# Altium schematic sheet Button.SchDoc
size 420 x 297 mm; Address1: Address1; Address2: Address2; Address3: Address3; Address4: Address4; DocumentNumber: *Э3; SheetNumber: 9; SheetTotal: 15; DocumentType: Схема электрическая *
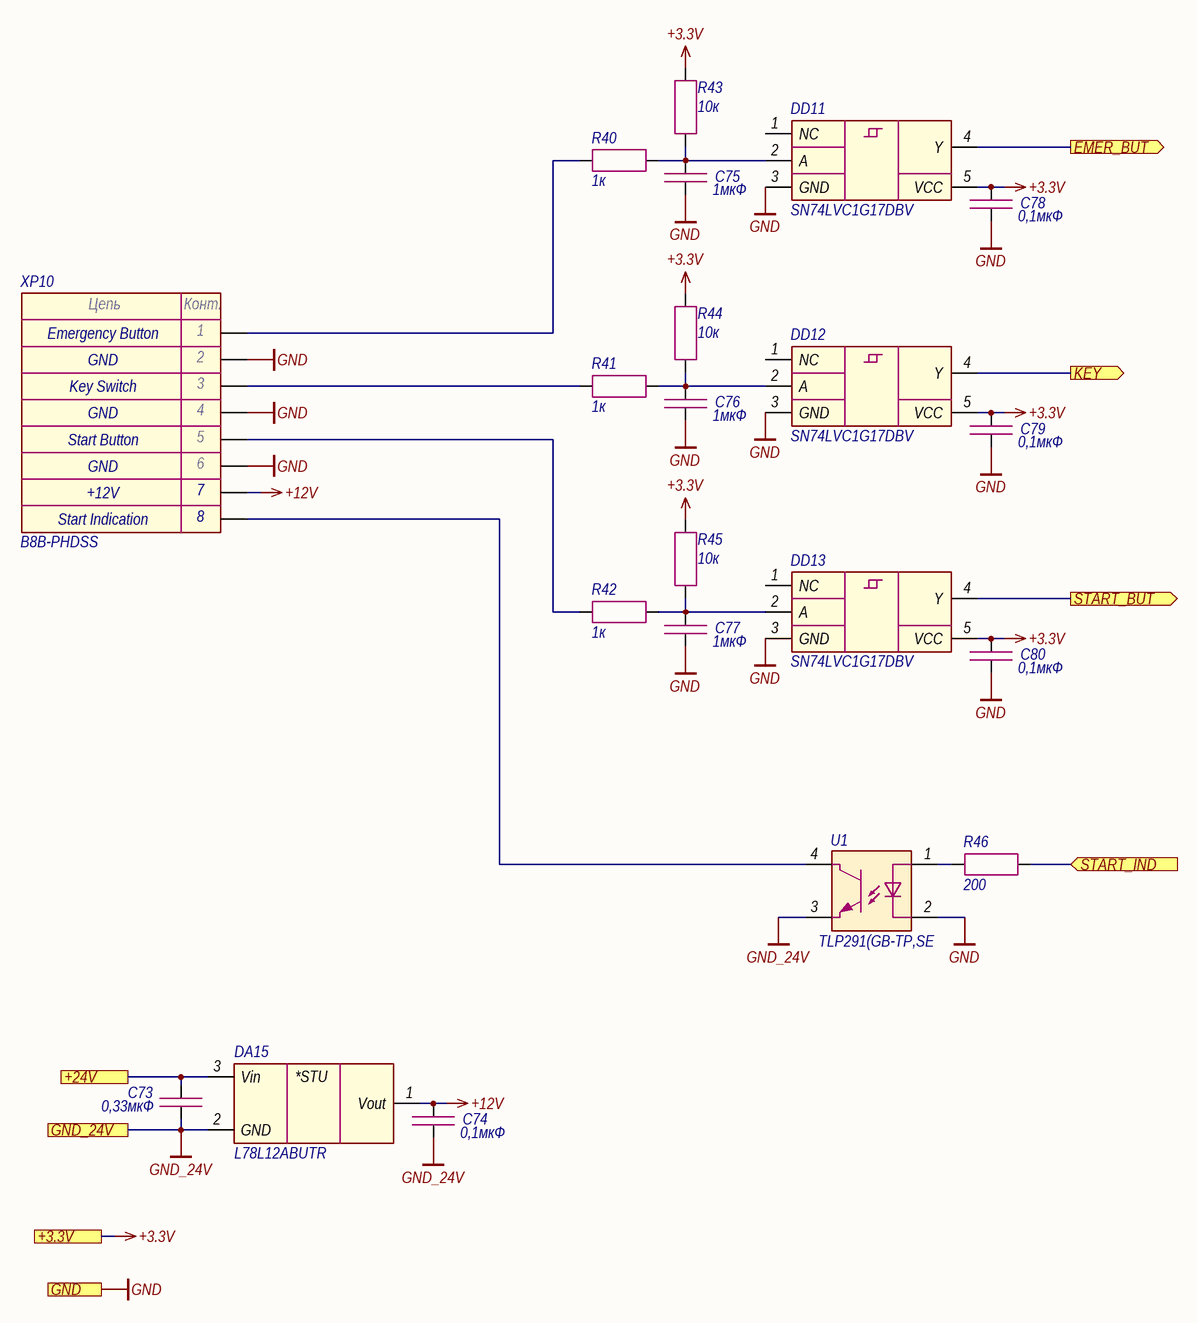
[diagram p0: Button.SchDoc]

## Parts
C73  0,33мкФ  [CAP_0805]
C74  0,1мкФ  [CAP_0603]
C75  1мкФ  [CAP_0603]
C76  1мкФ  [CAP_0603]
C77  1мкФ  [CAP_0603]
C78  0,1мкФ  [CAP_0603]
C79  0,1мкФ  [CAP_0603]
C80  0,1мкФ  [CAP_0603]
DA15  L78L12ABUTR  [SOT-89]
DD11  SN74LVC1G17DBV  [SOT-23-5]
DD12  SN74LVC1G17DBV  [SOT-23-5]
DD13  SN74LVC1G17DBV  [SOT-23-5]
R40  1к  [RES_0603]
R41  1к  [RES_0603]
R42  1к  [RES_0603]
R43  10к  [RES_0603]
R44  10к  [RES_0603]
R45  10к  [RES_0603]
R46  200  [RES_0603]
U1  TLP291(GB-TP,SE  [11-3C1]
XP10  B8B-PHDSS  [B8B-PHDSS]

## Ports
+3.3V (see Main[2C], Ethernet[3D], Fiber_interlock[2C], Flow_sensor[2C], Hardwiring[3D], LD_driver[1D], Power_supply[1D], Power_supply_CAN[1D], SF_driver[2C]), +24V (see Main[2C], Column[1C], Flow_sensor[2C], Hardwiring[3C], Indication[1C], LD_driver[1C], Power_supply[1D], Power_supply_CAN[1D]), EMER_BUT (out, see Main[2C]), GND (see Main[2C], Column[1C], Ethernet[3D], Fiber_interlock[2C], Flow_sensor[2C], Guide_laser[1C], Hardwiring[3D], Indication[1C], LD_driver[1D], Power_supply[1D], Power_supply_CAN[1D], SF_driver[2D]), GND_24V (see Main[2C], Column[1C], Flow_sensor[2C], Hardwiring[3C], Indication[1C], LD_driver[1D], Power_supply[1D], Power_supply_CAN[1D]), KEY (out, see Main[2C]), START_BUT (out, see Main[2C]), START_IND (in, see Main[2C])

## Nets
+3.3V: C78.1 C79.1 C80.1 DD11.5(VCC) DD12.5(VCC) DD13.5(VCC) R43.2 R44.2 R45.2 ; port +3.3V
+12V: C74.1 DA15.1(Vout) XP10.7
GND: C75.2 C76.2 C77.2 C78.2 C79.2 C80.2 DD11.3(GND) DD12.3(GND) DD13.3(GND) U1.2 XP10.2 XP10.4 XP10.6 ; port GND
GND_24V: C73.1 C74.2 DA15.2(GND) U1.3 ; port GND_24V
+24V: C73.2 DA15.3(Vin) ; port +24V
EMER_BUT: DD11.4(Y) ; port EMER_BUT
KEY: DD12.4(Y) ; port KEY
START_BUT: DD13.4(Y) ; port START_BUT
START_IND: R46.2 ; port START_IND
NetC75_1: C75.1 DD11.2(A) R40.2 R43.1
NetC76_1: C76.1 DD12.2(A) R41.2 R44.1
NetC77_1: C77.1 DD13.2(A) R42.2 R45.1
NetR40_1: R40.1 XP10.1
NetR41_1: R41.1 XP10.3
NetR42_1: R42.1 XP10.5
NetR46_1: R46.1 U1.1
NetU1_4: U1.4 XP10.8

Not connected (* = marked no-connect by the designer): DD11 1(NC); DD12 1(NC); DD13 1(NC)

## Notes on the sheet
- GND
- (near XP10) Emergency Button
- Start Button
- Key Switch
- +12V
- (near XP10) Start Indication
- Подп. и дата
- Инв. № дубл.
- Взам. инв. №
- Инв. № подл.
- Изм.
- Лист
- № докум.
- Подп.
- Дата
- Копировал
- Формат А3
- (in symbol Connector-8) Цепь; Конт.
- (in symbol LD2981ABU50TR) *STU

## Library data of the parts
C73 = Capacitor: Manufacturer: Murata; Model: GRM219R71H334KA88D; Value: 0,33мкФ; Document: *
C74 C78-C80 = Capacitor: Manufacturer: Murata; Model: GRM188R71H104KA93D; Value: 0,1мкФ; Document: *
C75-C77 = Capacitor: Manufacturer: Murata; Model: GRM188R61H105KAALD; Value: 1мкФ; Document: *
DA15 = LD2981ABU50TR: Manufacturer: STMicroelectronics; Model: L78L12ABUTR; Document: *
DD11-DD13 = SN74LVC1G17: Manufacturer: Texas Instruments; Model: SN74LVC1G17DBV; Document: *
R40-R42 = Resistor: Manufacturer: Yageo; Model: RC0603FR-071KL; Value: 1к; Document: *
R43-R45 = Resistor: Manufacturer: Yageo; Model: RC0603FR-0710KL; Value: 10к; Document: *
R46 = Resistor: Manufacturer: Yageo; Model: RC0603FR-07200RL; Value: 200; Document: *
U1 = TLP291: Manufacturer: Toshiba; Model: TLP291(GB-TP,SE; Document: *
XP10 = Connector-8: Manufacturer: JST; Model: B8B-PHDSS; Document: *